# Altium schematic sheet Mode sel.SchDoc
size A
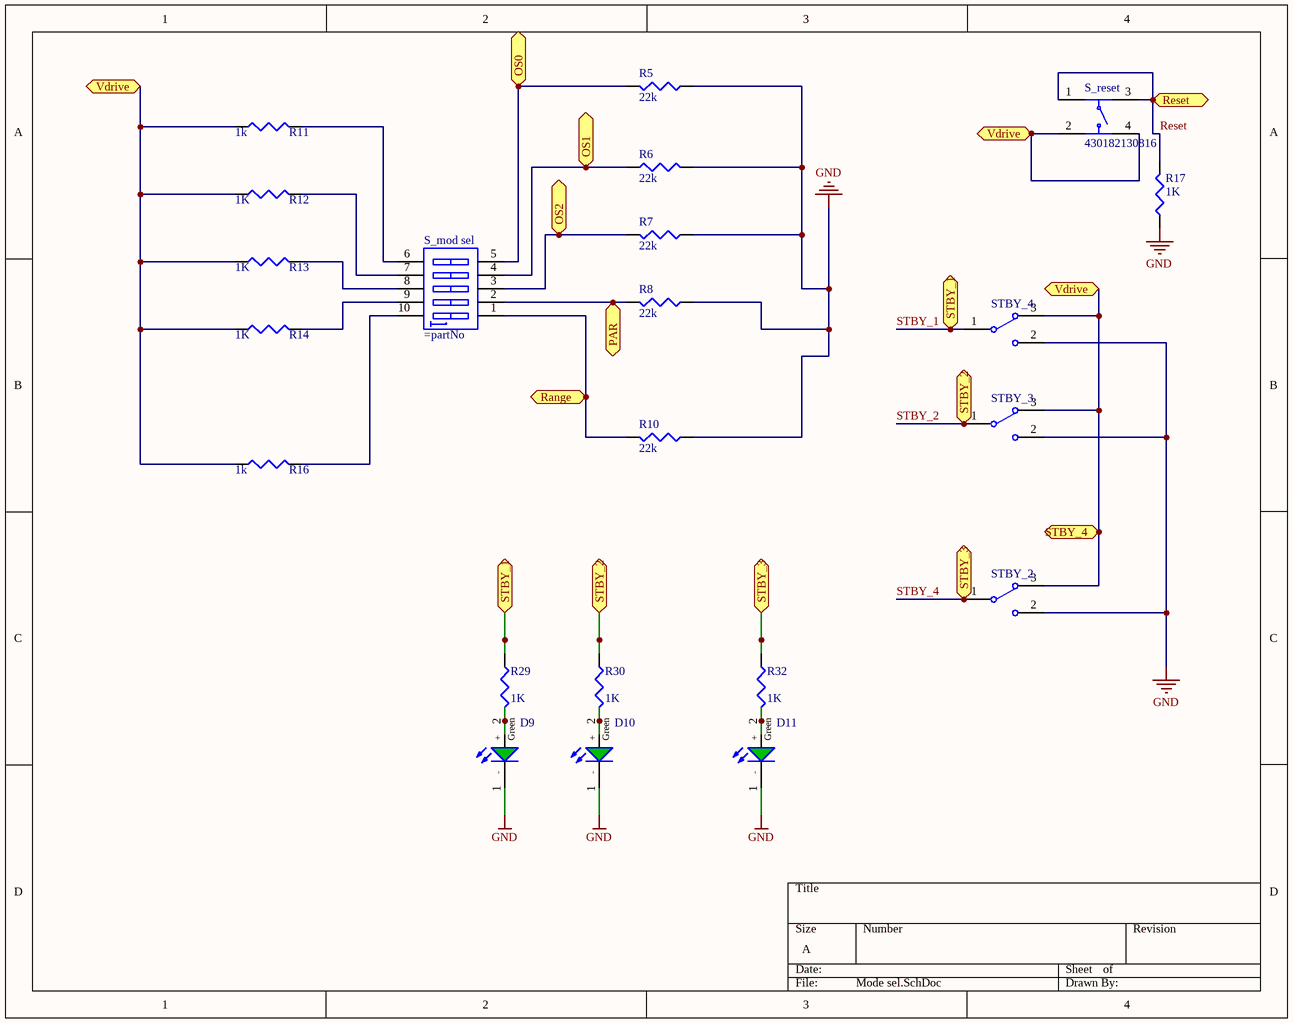
[diagram p0: Mode sel.SchDoc]

## Parts
D9  150060GS75000  [WL-SMCW_0603]  (value not drawn)
D10  150060GS75000  [WL-SMCW_0603]  (value not drawn)
D11  150060GS75000  [WL-SMCW_0603]  (value not drawn)
R5  value 22k  [J1-0603]
R6  value 22k  [J1-0603]
R7  value 22k  [J1-0603]
R8  value 22k  [J1-0603]
R10  value 22k  [J1-0603]
R11  value 1k  [J1-0603]
R12  value 1K  [J1-0603]
R13  value 1K  [J1-0603]
R14  value 1K  [J1-0603]
R16  value 1k  [J1-0603]
R17  value 1K  [J1-0603]
R29  value 1K  [J1-0603]
R30  value 1K  [J1-0603]
R32  value 1K  [J1-0603]
S_mod_sel  (no value)  [418121270805]
S_reset  430182130816  [4301x21308x6]
STBY_2  (no value)  [450301014042]
STBY_3  (no value)  [450301014042]
STBY_4  (no value)  [450301014042]

## Ports
OS0, OS1, OS2, PAR, Range, Reset, STBY_1, STBY_2, STBY_3, STBY_4, Vdrive

## Nets
GND: D9.1(-) D10.1(-) D11.1(-) R5.1 R6.2 R7.1 R8.1 R10.1 R17.1 STBY_2.2 STBY_3.2 STBY_4.2
OS0: R5.2 S_mod_sel.5 ; port OS0
OS1: R6.1 S_mod_sel.4 ; port OS1
OS2: R7.2 S_mod_sel.3 ; port OS2
PAR: R8.2 S_mod_sel.2 ; port PAR
Range: R10.2 S_mod_sel.1 ; port Range
Reset: R17.2 S_reset.1 S_reset.3 ; port Reset
STBY_1: R29.1 STBY_4.1(COM) ; port STBY_1
STBY_2: R30.1 STBY_3.1(COM) ; port STBY_2
STBY_4: R11.1 R12.1 R13.1 R14.1 R16.1 S_reset.2 S_reset.4 STBY_2.3 STBY_3.3 STBY_4.3 ; port STBY_4, port Vdrive
STBY_4: R32.1 STBY_2.1(COM) ; port STBY_3  [a separate net that carries the same name]
NetD9_2: D9.2(+) R29.2
NetD10_2: D10.2(+) R30.2
NetD11_2: D11.2(+) R32.2
NetR11_2: R11.2 S_mod_sel.6
NetR12_2: R12.2 S_mod_sel.7
NetR13_2: R13.2 S_mod_sel.8
NetR14_2: R14.2 S_mod_sel.9
NetR16_2: R16.2 S_mod_sel.10

## Notes on the sheet
- (in symbol WL-SMCW 0603, 150060GS75000) Green

## Library data of the parts
D9-D11 = WL-SMCW 0603, 150060GS75000: WL-SMCW SMD chip LED top view mono-color waterclear, 0603, Green; Manufacturer: Wurth Elektronik; PartNo: 150060GS75000; ComponentLink1Description: Manufacturer; ComponentLink1URL: http://www.we-online.de; Created by: Baojun Chen; Created Date: March 2016; ComponentLink2Description: Datasheet; ComponentLink2URL: http://katalog.we-online.de/led/datasheet/150060GS75000.pdf
R5-R8 R10-R14 R16 R17 R29 R30 R32 = Res3: Resistor; Published: 8-Jun-2000; LatestRevisionDate: 29-May-2009; LatestRevisionNote: IPC-7351 Footprint Added.; PackageReference: J1-0603; Publisher: Altium Limited; PackageDescription: Chip Resistor
S_mod_sel = WS-DISV, 418121270805: WS-DISV 2.54 mm small compact SMD with raised actuator; Manufacturer: Wurth Elektronik; ComponentLink1 Description: Manufacturer; ComponentLink2 Description: Datasheet; Pole: 05; Created Date: Dec.2015; Part No.: 418121270805; ComponentLink1URL: http://www.we-online.com; ComponentLink2URL: http://katalog.we-online.de/em/datasheet/4181212708xx.pdf; Created by: Baojun Chen
S_reset = WS-TASV, 430182130816: WS-TASV 6x6 mm SMD; Manufacturer: Wurth Elektronik; partNo: 430182130816; ComponentLink1Description: Manufacturer; ComponentLink1URL: http://www.we-online.de; Created by: Baojun Chen; Created Date: Dec.2015; ComponentLink2Description: Datasheet; ComponentLink2URL: http://katalog.we-online.de/em/datasheet/4301x2xxx8x6.pdf
STBY_2-STBY_4 = 450301014042: WS-SLTV 10x2.5 mm THT; ComponentLink1Description: Manufacturer; ComponentLink1URL: http://www.we-online.de; ComponentLink2Description: Datasheet; ComponentLink2URL: http://katalog.we-online.de/em/datasheet/450301014042.pdf; Part Number: 450301014042; Published Date: June 2017; Publisher: Wurth Elektronik